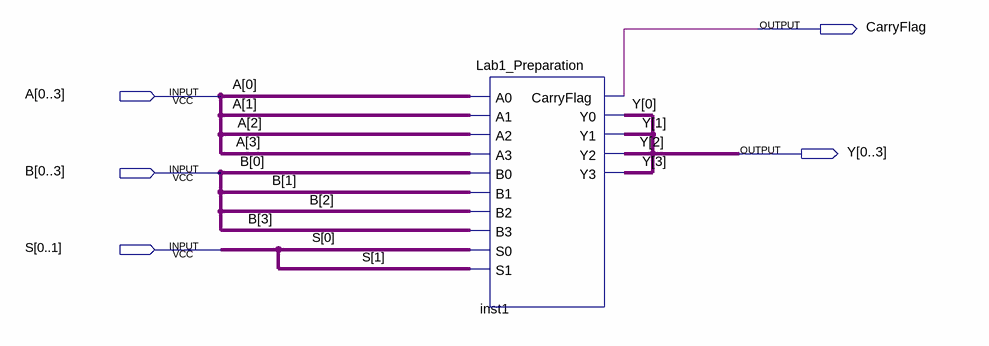
[diagram p0: schematic sheet]
// Quartus schematic ALUTest.bdf as structural Verilog: 1 symbols, 5 pins
module ALUTest (
  input  [0:3] A,
  input  [0:3] B,
  input  [0:1] S,
  output CarryFlag,
  output [0:3] Y
);

  Lab1_Preparation inst1 (
    .A0(A[0]), .A1(A[1]), .A2(A[2]), .A3(A[3]), .B0(B[0]), .B1(B[1]), .B2(B[2]), .B3(B[3]), .S0(S[0]),
    .S1(S[1]), .CarryFlag(CarryFlag), .Y0(Y[0]), .Y1(Y[1]), .Y2(Y[2]), .Y3(Y[3]));
endmodule
